# Altium schematic sheet STEP_MOTOR_DRIVER_1.SchDoc
size 420 x 297 mm; SheetNumber: 11; SheetTotal: 20
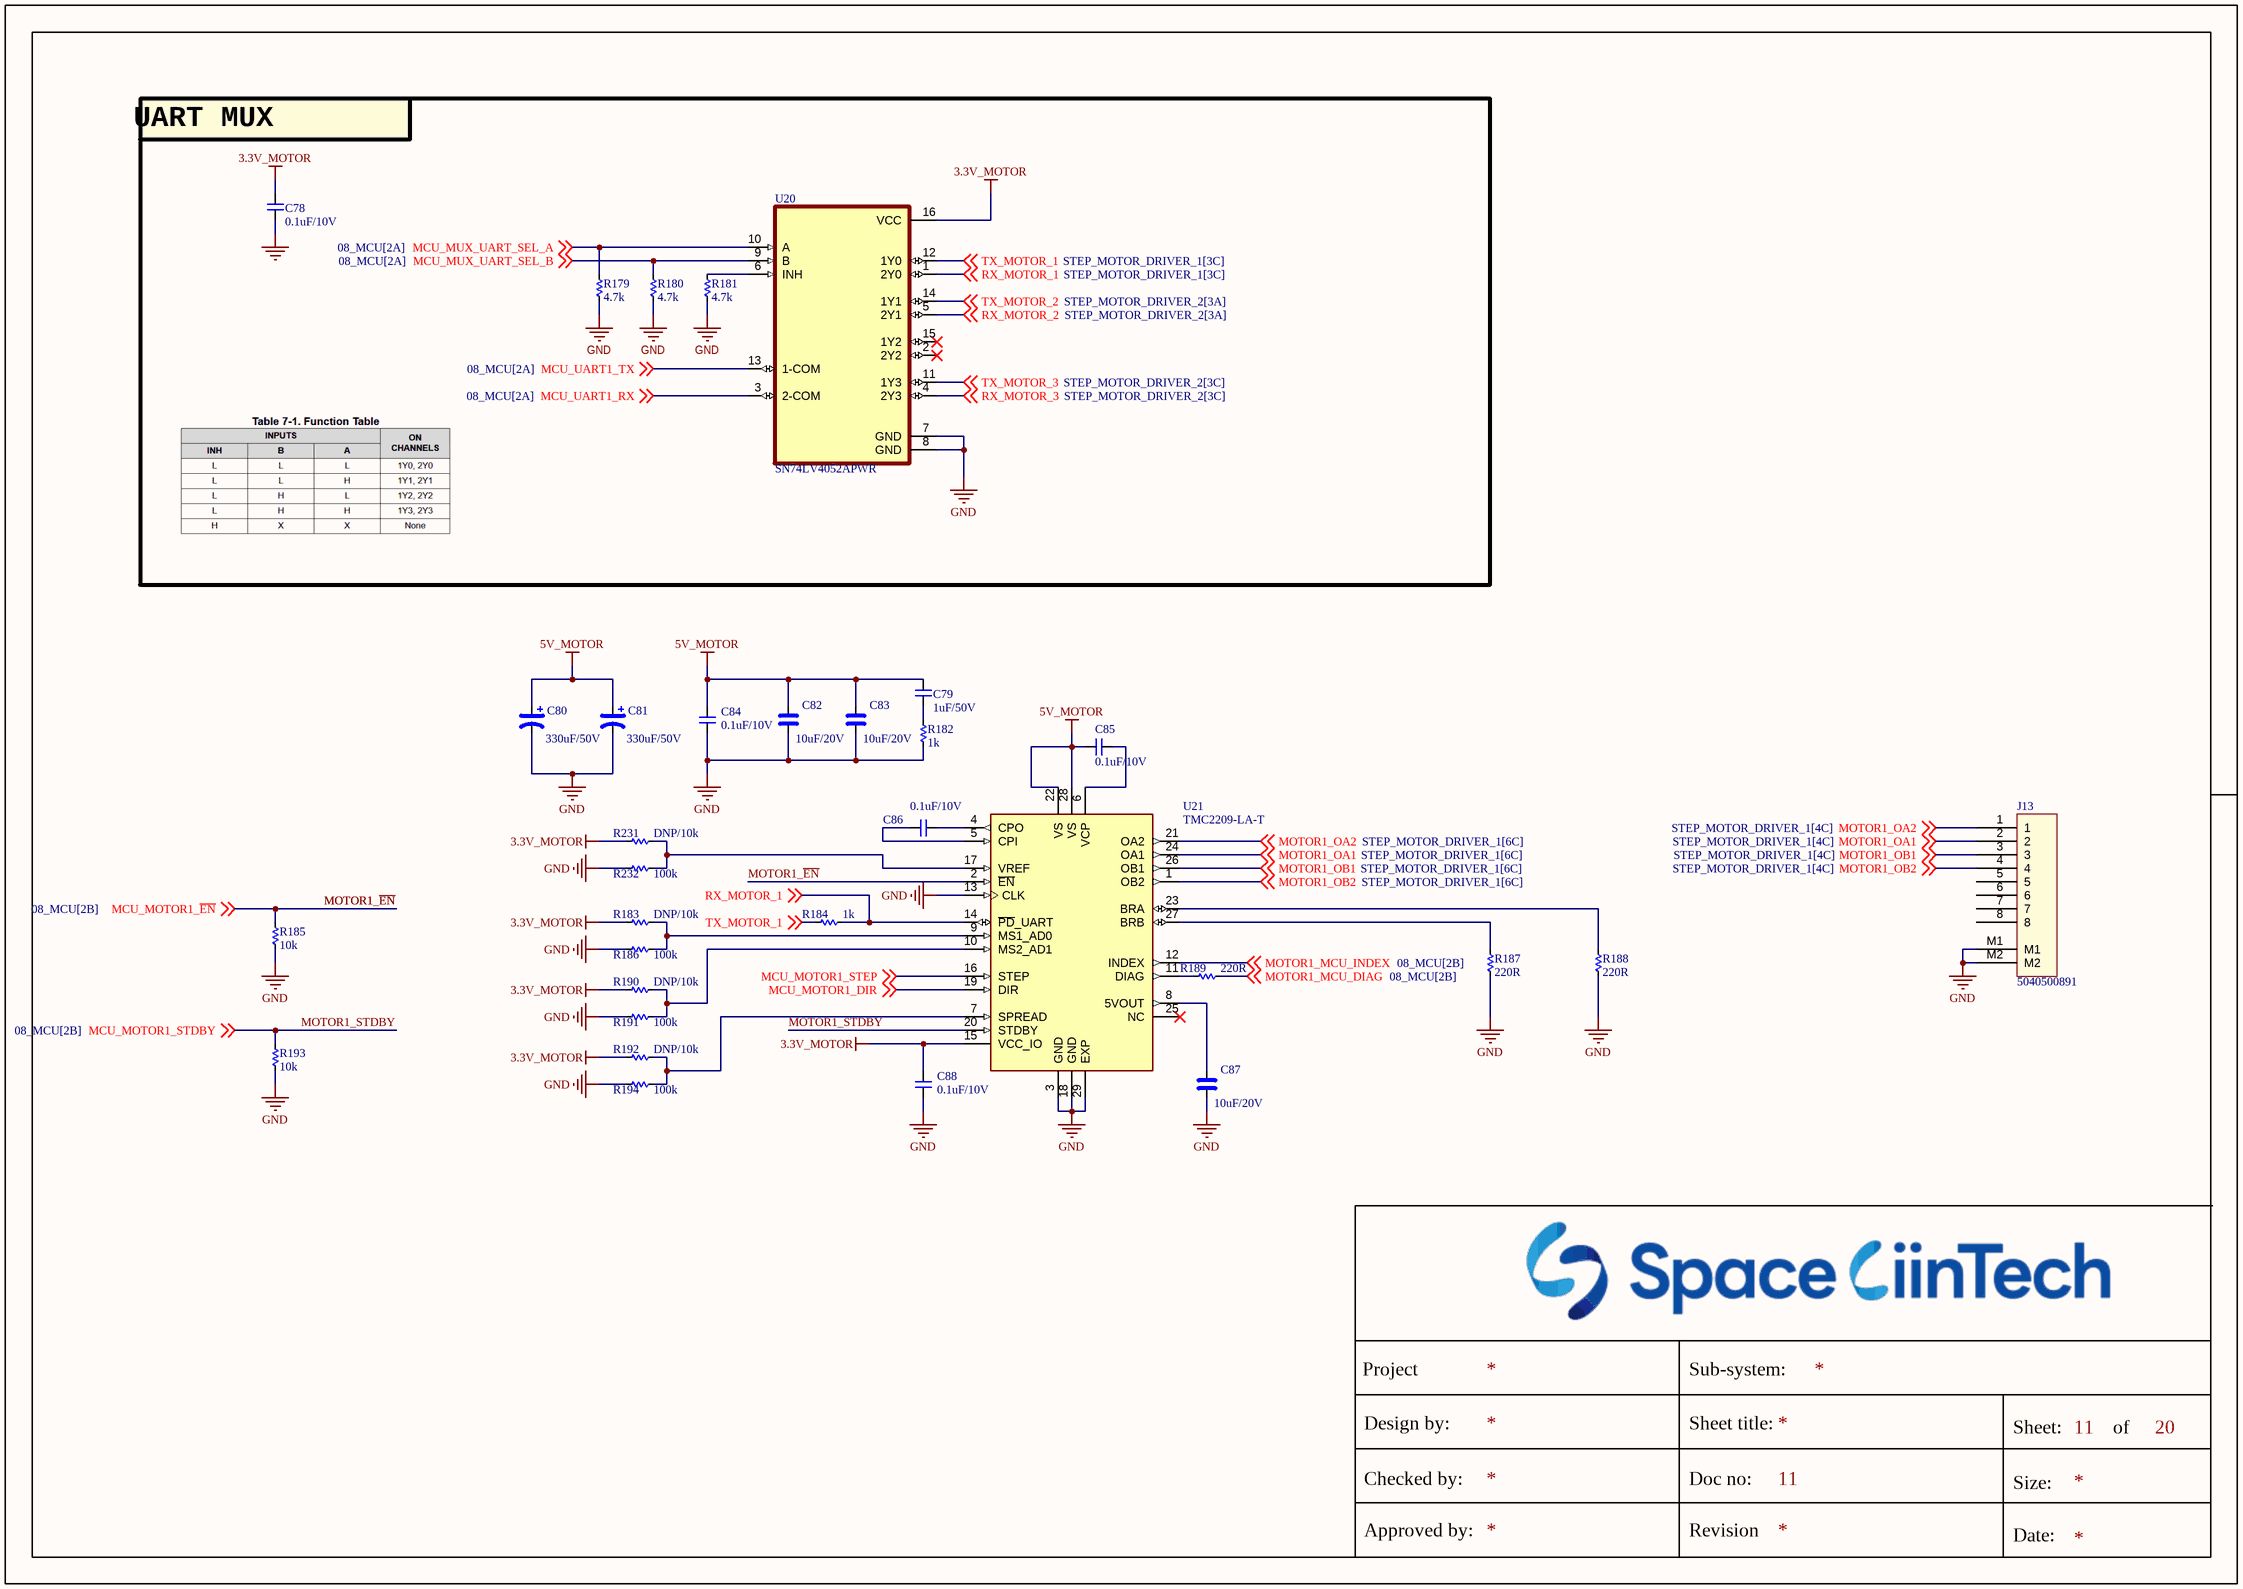
[diagram p0: STEP_MOTOR_DRIVER_1.SchDoc]

## Parts
C78  0.1uF/10V  [CAP_C_1005X50_L]
C79  1uF/50V  [CAP_C_1005X50_L]
C80  330uF/50V  [CAP_MP_3216X180]
C81  330uF/50V  [CAP_MP_3216X180]
C82  10uF/20V  [CAP_C_2012X110]
C83  10uF/20V  [CAP_C_2012X110]
C84  0.1uF/10V  [CAP_C_1005X50_L]
C85  0.1uF/10V  [CAP_C_1005X50_L]
C86  0.1uF/10V  [CAP_C_1005X50_L]
C87  10uF/20V  [CAP_C_2012X110]
C88  0.1uF/10V  [CAP_C_1005X50_L]
J13  5040500891  [MOLEX_5040500891]
R179  4.7k  [RES_C_1005x30_L]
R180  4.7k  [RES_C_1005x30_L]
R181  4.7k  [RES_C_1005x30_L]
R182  1k  [RES_C_1005X40]
R183  DNP/10k  [RES_C_1005X40]
R184  1k  [RES_C_1005X40]
R185  10k  [RES_C_1005X40]
R186  100k  [RES_C_1005X40]
R187  220R  [RES_C_1005X40]
R188  220R  [RES_C_1005X40]
R189  220R  [RES_C_1005X40]
R190  DNP/10k  [RES_C_1005X40]
R191  100k  [RES_C_1005X40]
R192  DNP/10k  [RES_C_1005X40]
R193  10k  [RES_C_1005X40]
R194  100k  [RES_C_1005X40]
R231  DNP/10k  [RES_C_1005X40]
R232  100k  [RES_C_1005X40]
U20  SN74LV4052APWR  [SOP65P640X120-16N]
U21  TMC2209-LA-T  [QFN50P500X500X90-29N]

## Blocks framed on the sheet
UART MUX: C78 R179-R181 U20

## Nets
3.3V_MOTOR: C78.2 C88.2 R183.2 R190.2 R192.2 R231.2 U20.16(VCC) U21.15(VCC_IO)
5V_MOTOR: C79.2 C80.1 C81.1 C82.1 C83.1 C84.2 C85.2 U21.22(VS) U21.28(VS)
GND: C78.1 C80.2 C81.2 C82.2 C83.2 C84.1 C87.2 C88.1 J13.M1 J13.M2 R179.2 R180.2 R181.2 R182.1 R185.1 R186.2 R187.2 R188.2 R191.2 R193.1 R194.2 R232.2 U20.7(GND) U20.8(GND) U21.3(GND) U21.13(CLK) U21.18(GND) U21.29(EXP)
MCU_MOTOR1_DIR: U21.19(DIR) ; off-sheet MCU_MOTOR1_DIR
MCU_MOTOR1_STEP: U21.16(STEP) ; off-sheet MCU_MOTOR1_STEP
MCU_MUX_UART_SEL_A: R179.1 U20.10(A) ; off-sheet MCU_MUX_UART_SEL_A
MCU_MUX_UART_SEL_B: R180.1 U20.9(B) ; off-sheet MCU_MUX_UART_SEL_B
MCU_UART1_RX: U20.3(2-COM) ; off-sheet MCU_UART1_RX
MCU_UART1_TX: U20.13(1-COM) ; off-sheet MCU_UART1_TX
MOTOR1_~{EN}: R185.2 U21.2(~{EN}) ; off-sheet MCU_MOTOR1_~{EN}  [also labelled MCU_MOTOR1_~{EN}]
MOTOR1_MCU_DIAG: R189.2 ; off-sheet MOTOR1_MCU_DIAG
MOTOR1_MCU_INDEX: U21.12(INDEX) ; off-sheet MOTOR1_MCU_INDEX
MOTOR1_OA1: J13.2 U21.24(OA1) ; off-sheet MOTOR1_OA1
MOTOR1_OA2: J13.1 U21.21(OA2) ; off-sheet MOTOR1_OA2
MOTOR1_OB1: J13.3 U21.26(OB1) ; off-sheet MOTOR1_OB1
MOTOR1_OB2: J13.4 U21.1(OB2) ; off-sheet MOTOR1_OB2
MOTOR1_STDBY: R193.2 U21.20(STDBY) ; off-sheet MCU_MOTOR1_STDBY  [also labelled MCU_MOTOR1_STDBY]
RX_MOTOR_1: R184.2 U20.1(2Y0) U21.14(~{PD}_UART) ; off-sheet RX_MOTOR_1
RX_MOTOR_2: U20.5(2Y1) ; off-sheet RX_MOTOR_2
RX_MOTOR_3: U20.4(2Y3) ; off-sheet RX_MOTOR_3
TX_MOTOR_1: R184.1 U20.12(1Y0) ; off-sheet TX_MOTOR_1
TX_MOTOR_2: U20.14(1Y1) ; off-sheet TX_MOTOR_2
TX_MOTOR_3: U20.11(1Y3) ; off-sheet TX_MOTOR_3
NetC79_1: C79.1 R182.2
NetC85_1: C85.1 U21.6(VCP)
NetC86_1: C86.1 U21.4(CPO)
NetC86_2: C86.2 U21.5(CPI)
NetC87_1: C87.1 U21.8(5VOUT)
NetR181_1: R181.1 U20.6(INH)
NetR183_1: R183.1 R186.1 U21.9(MS1_AD0)
NetR187_1: R187.1 U21.27(BRB)
NetR188_1: R188.1 U21.23(BRA)
NetR189_1: R189.1 U21.11(DIAG)
NetR190_1: R190.1 R191.1 U21.10(MS2_AD1)
NetR192_1: R192.1 R194.1 U21.7(SPREAD)
NetR231_1: R231.1 R232.1 U21.17(VREF)

Not connected (* = marked no-connect by the designer): J13 5 6 7 8; U20 2(2Y2)* 15(1Y2)*; U21 25(NC)*

## Notes on the sheet
- Project
- Sub-system:
- Design by:
- Sheet title:
- Sheet:
- of
- Checked by:
- Approved by:
- Doc no:
- Revision
- Size:
- Date:

## Library data of the parts
C78 C79 C84-C86 C88 = _CAP_C_2: CAP
C80 C81 = _CAP_Pola_High_2: CAP Polarization High Value
C82 C83 C87 = _CAP_C_High_2: CAP High Value
J13 = Header 8x1_2M
R179-R194 R231 R232 = _RES_B_2: RES
U20 = SN74LV4052APWR: 5-V, 4:1, 2-channel analog multiplexer; MF: Texas Instruments; SnapEDA_Link: https://www.snapeda.com/parts/SN74LV4052APWR/Texas+Instruments/view-part/?ref=snap; Package: TSSOP-16 Texas Instruments; Value: *; MP: SN74LV4052APWR; Check_prices: https://www.snapeda.com/parts/SN74LV4052APWR/Texas+Instruments/view-part/?ref=eda
U21 = TMC2209-LA-T: Bipolar Motor Driver Power MOSFET Step/Direction, UART 28-QFN (5x5); MF: Trinamic Motion Control GmbH; SnapEDA_Link: https://www.snapeda.com/parts/TMC2209-LA-T/Trinamic/view-part/?ref=snap; Package: VFQFN-28 Trinamic; Value: *; MP: TMC2209-LA-T; Check_prices: https://www.snapeda.com/parts/TMC2209-LA-T/Trinamic/view-part/?ref=eda